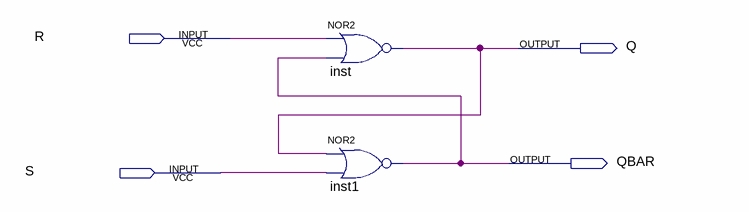
[diagram p0: schematic sheet]
// Quartus schematic sr.bdf as structural Verilog: 2 symbols, 4 pins
module sr (
  input  R,
  input  S,
  output Q,
  output QBAR
);

  nor inst (Q, R, QBAR);
  nor inst1 (QBAR, Q, S);
endmodule
